# EasyEDA schematic Turbin_Board_Hijau.json
TITLE: Sheet_2; REV: 1.0; Date: 2024-07-23; Sheet: 1/1; Drawn By: ulirberdulham; Company: Your Company
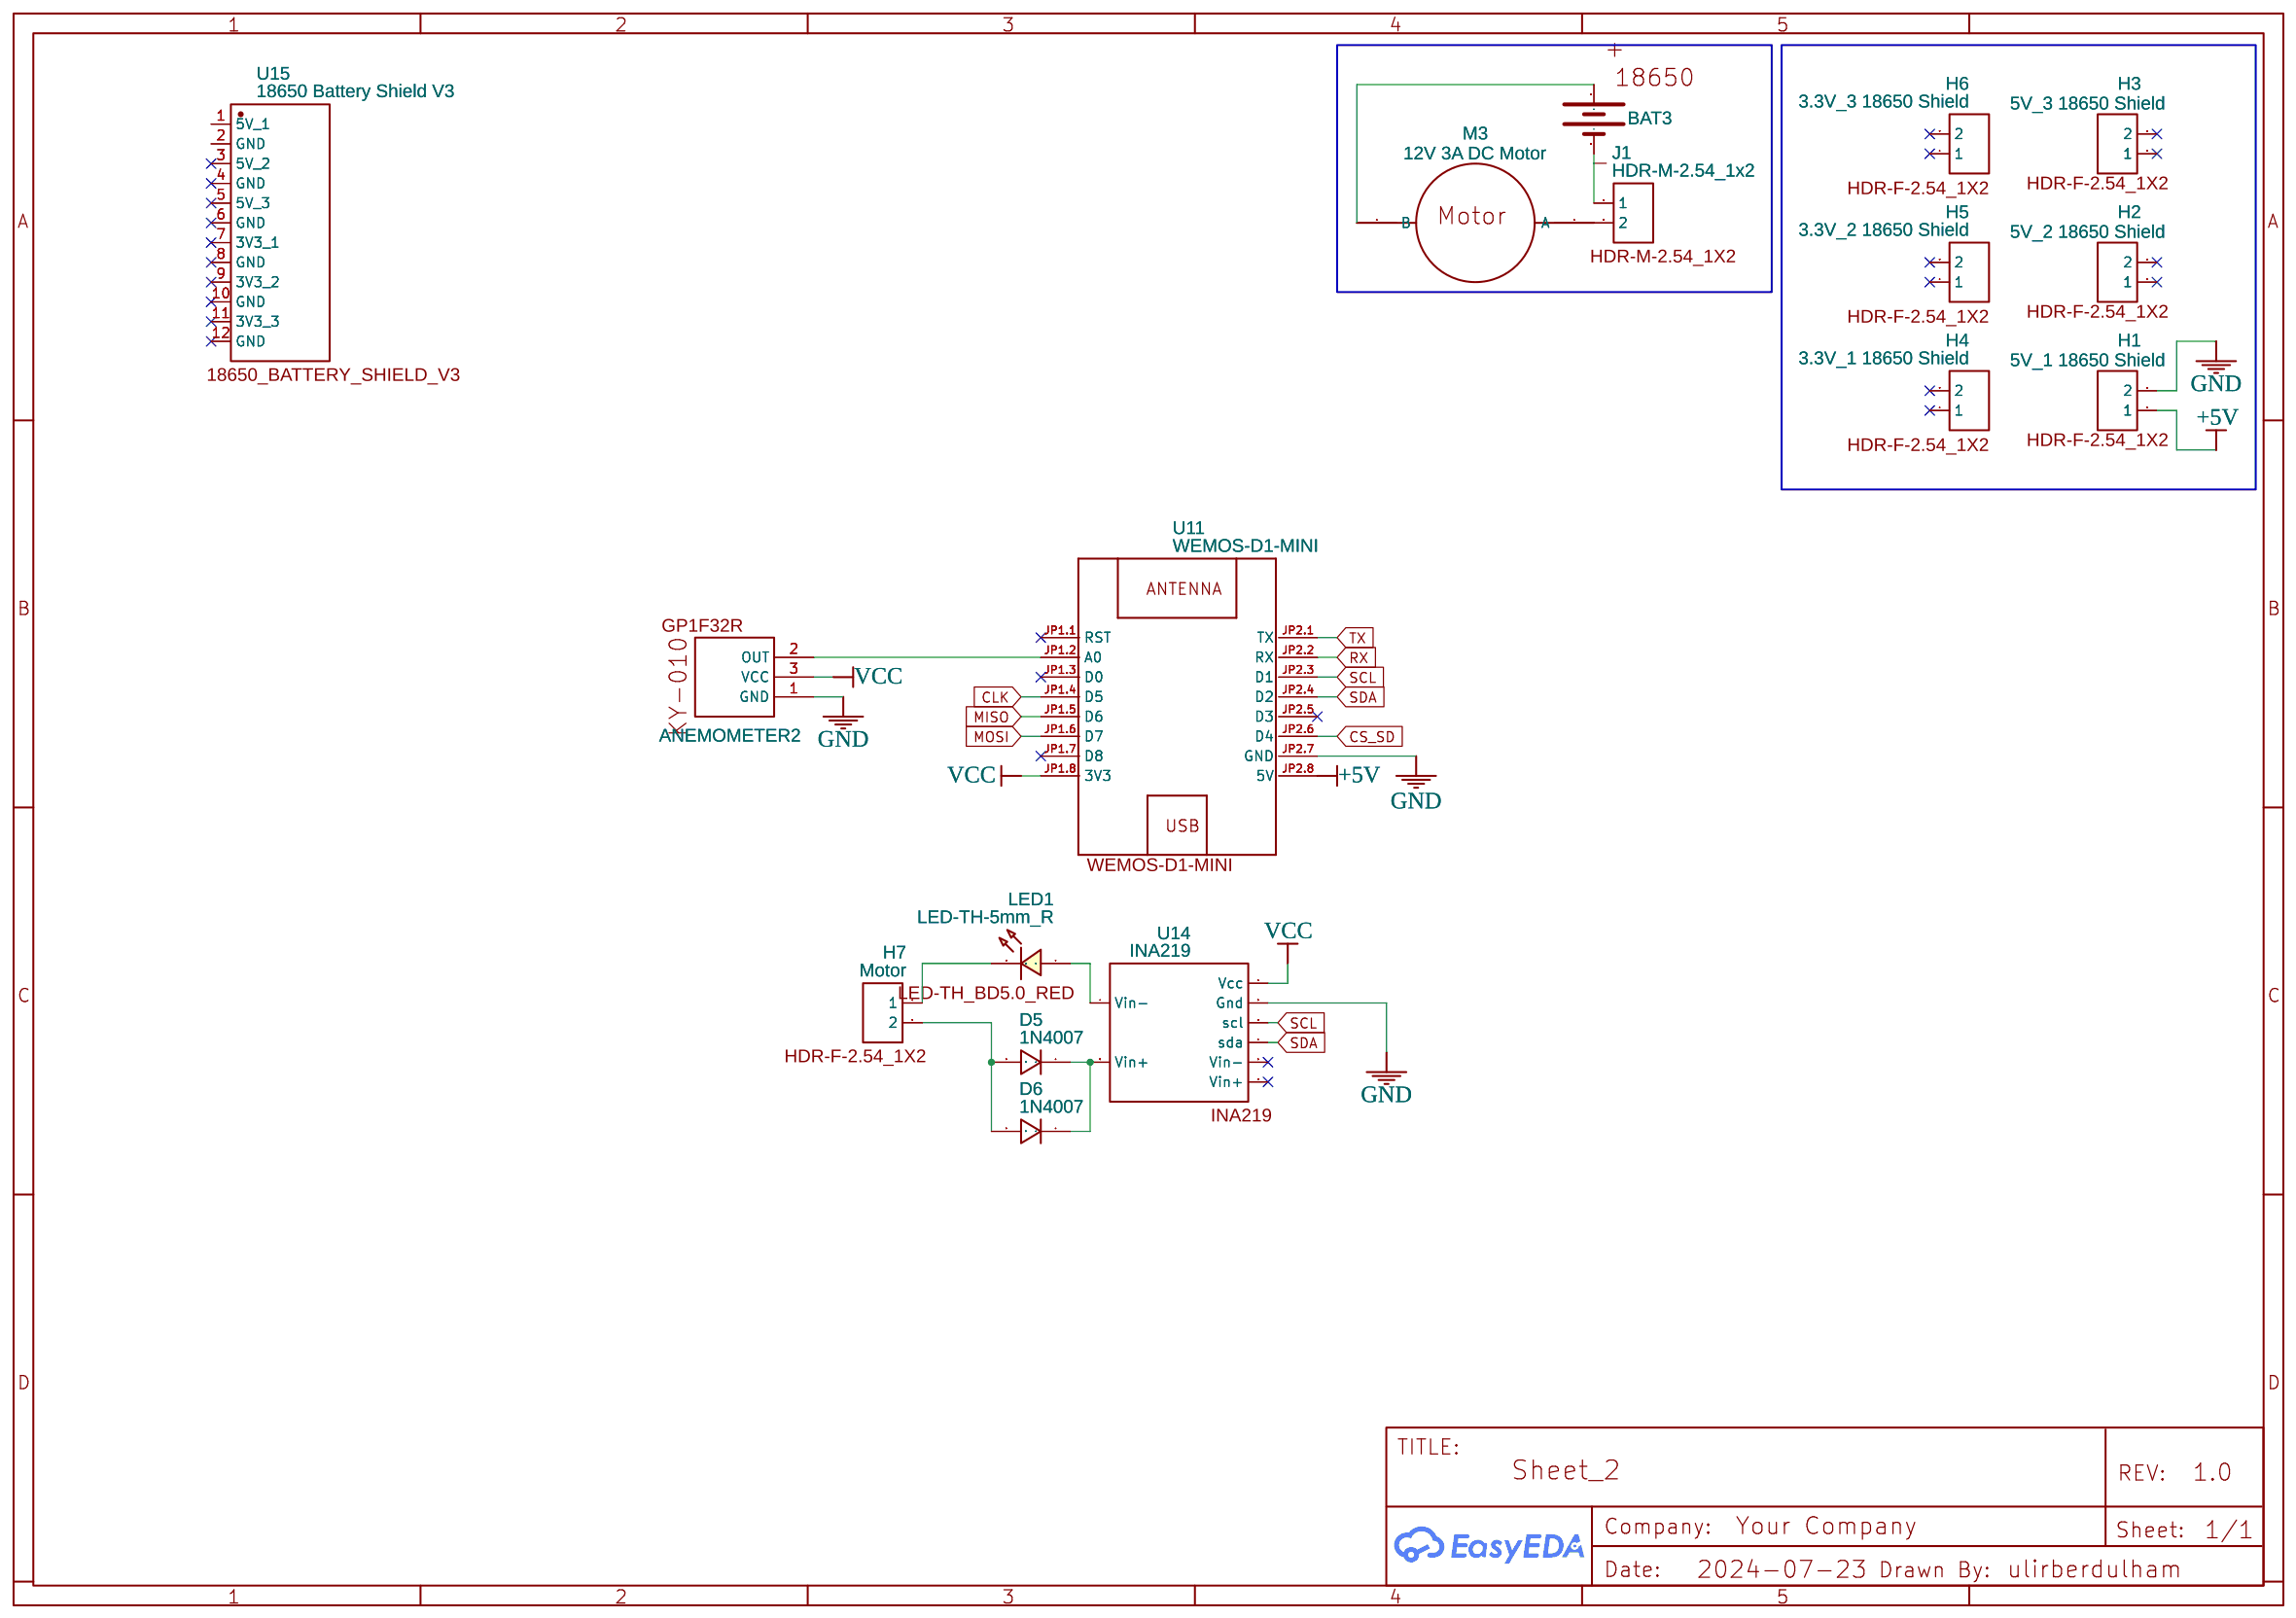
[diagram p0: schematic sheet]

## Parts
ANEMOMETER2  KY-010  [GP1F32R]
BAT3  BATTERY 18650  [ADAFRUIT 18650 BATTERY HOLDER KFLMIAMI420 BH-18650-PC-ND]
D5  1N4007  [DO-41_BD2.4-L4.7-P8.70-D0.9-RD]
D6  1N4007  [DO-41_BD2.4-L4.7-P8.70-D0.9-RD]
H1  5V_1 18650 Shield  [HDR-F-2.54_1X2]
H2  5V_2 18650 Shield  [HDR-F-2.54_1X2]
H3  5V_3 18650 Shield  [HDR-F-2.54_1X2]
H4  3.3V_1 18650 Shield  [HDR-F-2.54_1X2]
H5  3.3V_2 18650 Shield  [HDR-F-2.54_1X2]
H6  3.3V_3 18650 Shield  [HDR-F-2.54_1X2]
H7  Motor  [HDR-F-2.54_1X2]
J1  HDR-M-2.54_1x2  [HDR-M-2.54_1X2]
LED1  LED-TH-5mm_R  [LED-TH_BD5.0_RED]
M3  12V 3A DC Motor  [12V 3A  DC MOTOR]
U11  WEMOS-D1-MINI  [WEMOS-D1-MINI]
U14  INA219  [INA219]
U15  18650 Battery Shield V3  [18650_BATTERY_SHIELD_V3]

## Library data of the parts
ANEMOMETER2 = KY-010: Supplier: CHINA (Aliexpress); Contributor: dawidek; Package Display: Yes
BAT3 = BATTERY 18650: Contributor: fsergiy; Manufacturer Part: battery; Package Display: No
D5 D6 = 1N4007: Supplier: LCSC; Manufacturer: SEMTECH; Supplier Part: C106903; Contributor: LCEDA_Lib; Package Display: No
H1-H7 = HDR-F-2.54_1x2: Supplier Part: C49661; Supplier: LCSC; Contributor: LCEDA_Lib; Package Display: Yes
J1 = HDR-M-2.54_1x2: Supplier Part: C124375; Supplier: LCSC; Contributor: LCEDA_Lib; Package Display: Yes
LED1 = LED-TH-5mm_R: Manufacturer: EVERLIGHT(台湾亿光); Manufacturer Part: 333-2SURD/S530-A3; Supplier Part: C87271; Supplier: LCSC; Contributor: LCEDA_Lib; Package Display: Yes
M3 = 12V 3A DC Motor: Contributor: 315151; Package Display: No
U11 = WEMOS-D1-MINI: Contributor: hollandacocobear; Package Display: Yes
U14 = INA219: Contributor: TrikerDK; Package Display: Yes
U15 = 18650 Battery Shield V3: Contributor: Babooon; Package Display: Yes

## Nets
+5V: H1.1 U11.JP2.8(5V)
GND: ANEMOMETER2.1(GND) H1.2 U11.JP2.7(GND) U14.2(Gnd)
VCC: ANEMOMETER2.3(VCC) U11.JP1.8(3V3) U14.1(Vcc)
CLK: U11.JP1.4(D5)
CS_SD: U11.JP2.6(D4)
MISO: U11.JP1.5(D6)
MOSI: U11.JP1.6(D7)
RX: U11.JP2.2(RX)
SCL: U11.JP2.3(D1) U14.3(scl)
SDA: U11.JP2.4(D2) U14.4(sda)
TX: U11.JP2.1(TX)
Net-(ANEMOMETER2-2): ANEMOMETER2.2(OUT) U11.JP1.2(A0)
Net-(BAT3-1): BAT3.1(+) M3.2(B)
Net-(BAT3-2): BAT3.2(-) J1.1
Net-(D5-1): D5.1 D6.1 U14.8(Vin+)
Net-(D5-2): D5.2 D6.2 H7.2
Net-(H7-1): H7.1 LED1.2
Net-(J1-2): J1.2 M3.1(A)
Net-(LED1-1): LED1.1 U14.7(Vin-)

Not connected (* = marked no-connect by the designer): H2 1* 2*; H3 1* 2*; H4 1* 2*; H5 1* 2*; H6 1* 2*; U11 JP1.1(RST)* JP1.3(D0)* JP1.7(D8)* JP2.5(D3)*; U14 5(Vin-)* 6(Vin+)*; U15 1(5V) 2(GND) 3(5V_2)* 4(GND)* 5(5V_3)* 6(GND)* 7(3V3_1)* 8(GND)* 9(3V3_2)* 10(GND)* 11(3V3_3)* 12(GND)*
